# Altium schematic sheet Button and more.SchDoc
size A; SheetNumber: 3; SheetTotal: 15
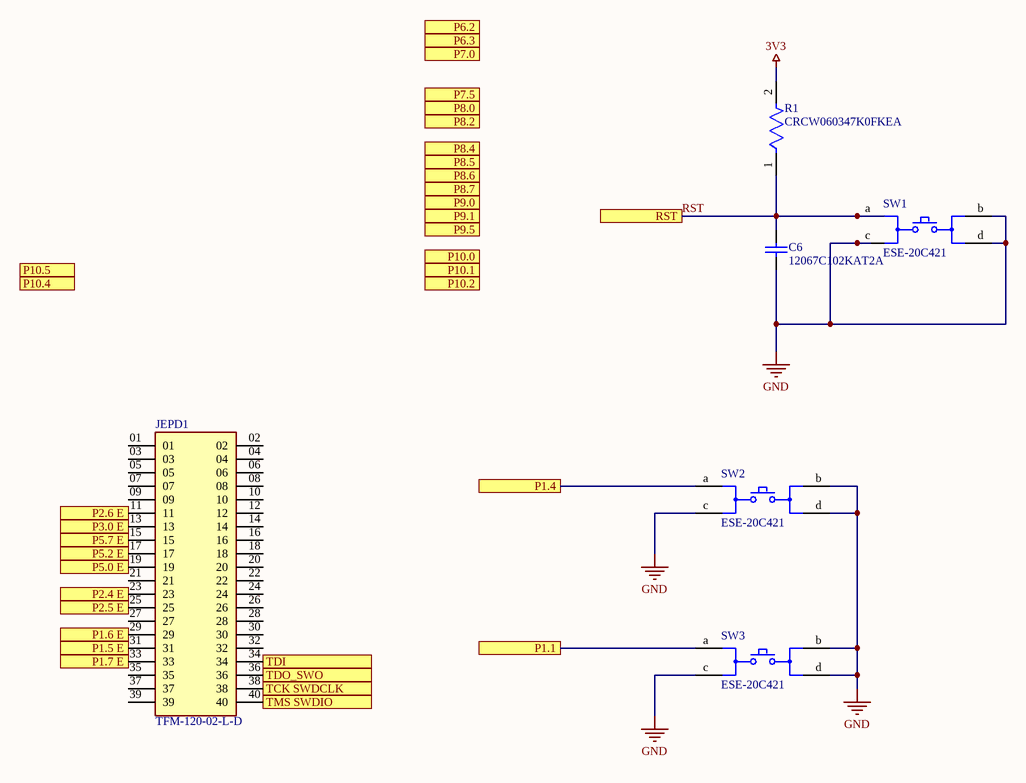
[diagram p0: Button and more.SchDoc]

## Parts
C6  12067C102KAT2A  [CAPC3216X102X50LL20T25]
JEPD1  TFM-120-02-L-D  [SAMTEC_TFM-120-02-L-D]
R1  CRCW060347K0FKEA  [FP-CRCW0603-e3-MFG]
SW1  ESE-20C421  [FP-ESE-20C421-MFG]
SW2  ESE-20C421  [FP-ESE-20C421-MFG]
SW3  ESE-20C421  [FP-ESE-20C421-MFG]

## Ports
P1.1, P1.4, P1.5 E (out), P1.6 E (out), P1.7 E (out), P2.4 E (out), P2.5 E (out), P2.6 E (out), P3.0 E (out), P5.0 E (out), P5.2 E (out), P5.7 E (out), P6.2, P6.3, P7.0, P7.5, P8.0, P8.2, P8.4, P8.5, P8.6, P8.7, P9.0, P9.1, P9.5, P10.0, P10.1, P10.2, P10.4, P10.5, RST, TCK SWDCLK, TDI, TDO_SWO, TMS SWDIO

## Nets
3V3: R1.2
GND: C6.1 SW1.b SW1.c SW1.d SW2.b SW2.c SW2.d SW3.b SW3.c SW3.d
P1.1: SW3.a ; port P1.1
P1.4: SW2.a ; port P1.4
P1.5 E: JEPD1.31 ; port P1.5 E
P1.6 E: JEPD1.29 ; port P1.6 E
P1.7 E: JEPD1.33 ; port P1.7 E
P2.4 E: JEPD1.23 ; port P2.4 E
P2.5 E: JEPD1.25 ; port P2.5 E
P2.6 E: JEPD1.11 ; port P2.6 E
P3.0 E: JEPD1.13 ; port P3.0 E
P5.0 E: JEPD1.19 ; port P5.0 E
P5.2 E: JEPD1.17 ; port P5.2 E
P5.7 E: JEPD1.15 ; port P5.7 E
RST: C6.2 R1.1 SW1.a ; port RST
TCK SWDCLK: JEPD1.38 ; port TCK SWDCLK
TDI: JEPD1.34 ; port TDI
TDO_SWO: JEPD1.36 ; port TDO_SWO
TMS SWDIO: JEPD1.40 ; port TMS SWDIO

Not connected (* = marked no-connect by the designer): JEPD1 01 02 03 04 05 06 07 08 09 10 12 14 16 18 20 21 22 24 26 27 28 30 32 35 37 39

## Notes on the sheet
- Labels drawn without touching a wire or pin: \

## Library data of the parts
C6 = CMP-1037-02486-2: Chip Capacitor, 1 nF, +/- 10%, 500 V, -55 to 125 degC, 1206 (3216 Metric), RoHS, Tape and Reel; Manufacturer: AVX; Rated Voltage: 500V; Dielectric: X7R; Capacitance: 1nF; Manufacturer URL: http://www.avx.com/; Case Size/Dimension: 1206; Package Reference: 1206; Datasheet Version: 07/2016; Datasheet URL: http://datasheets.avx.com/X7RDielectric.pdf; Package Description: 2-Pin Surface Mount Device, Body 3.2 x 1.6 mm; Tolerance (%): ±10%; Mounting Technology: SurfaceMount
JEPD1 = TFM-120-02-L-D: MF: Samtec; Availability: Unavailable; MP: TFM-120-02-L-D; Price: None; Package: None; Value: *
R1 = CMP-2000-03379-3: RES SMD 47K OHM 1% 1/10W 0603; Voltage Rating (DC): 75V; Power Rating: 100mW; Temperature Coefficient: 100ppm/°C; Resistance: 47kR; Package Quantity: 5000; Length: 1.55mm; Case Code (Metric): 1608; Packaging: Tape and Reel; Depth: 0.85mm; Lead Free: Lead Free; Mount: Surface Mount; Termination: SMD/SMT; Military Standard: Not; Tolerance: 1%; Min Operating Temperature: -55°C; Case/Package: 0603; Height: 0.45mm; Voltage Rating: 75V; Case Code (Imperial): 0603; Width: 0.85mm; Weight: 7.1E-05oz; Radiation Hardening: No; Contact Plating: Tin; Max Operating Temperature: 155°C; Size Code: 0603; Technology: THICK FILM; Number of Terminations: 2; Series: CRCW; RoHS Compliant: Yes; Resistance Tolerance: 1%; Max Power Dissipation: 100mW; Resistor Type: Thick Film; Features: Automotive AEC-Q200; Construction: Rectangular
SW1-SW3 = CMP-05613-000006-1: SWITCH PUSH SPST-NO 0.1A 14V; Current Rating: 100mA; Switch Function: Off-Mom; Throw Configuration: SPST; Actuator Type: Lever; Operating Force: 4N; Actuator Length: 5.5mm; Series: ESE20C; Package Quantity: 1200; Radiation Hardening: No; Max Voltage Rating (DC): 14V; Voltage Rating (DC): 14V; Max Operating Temperature: 80°C; Lead Free: Lead Free; Mount: Through Hole; Termination: PC Pin; Packaging: Bulk; Min Operating Temperature: -30°C; RoHS Compliant: Yes; Contact Current Rating: 100mA; REACH SVHC: No SVHC; Orientation: Straight